# Altium schematic sheet MainSchema.SchDoc
size A4
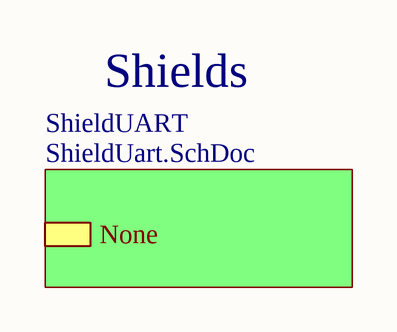
[diagram p0: MainSchema.SchDoc]

## Sub-sheets
ShieldUART = ShieldUart.SchDoc: None

## Notes on the sheet
- Shields